# Altium schematic sheet ESP32.SchDoc
size A; SheetNumber: 2; SheetTotal: 5
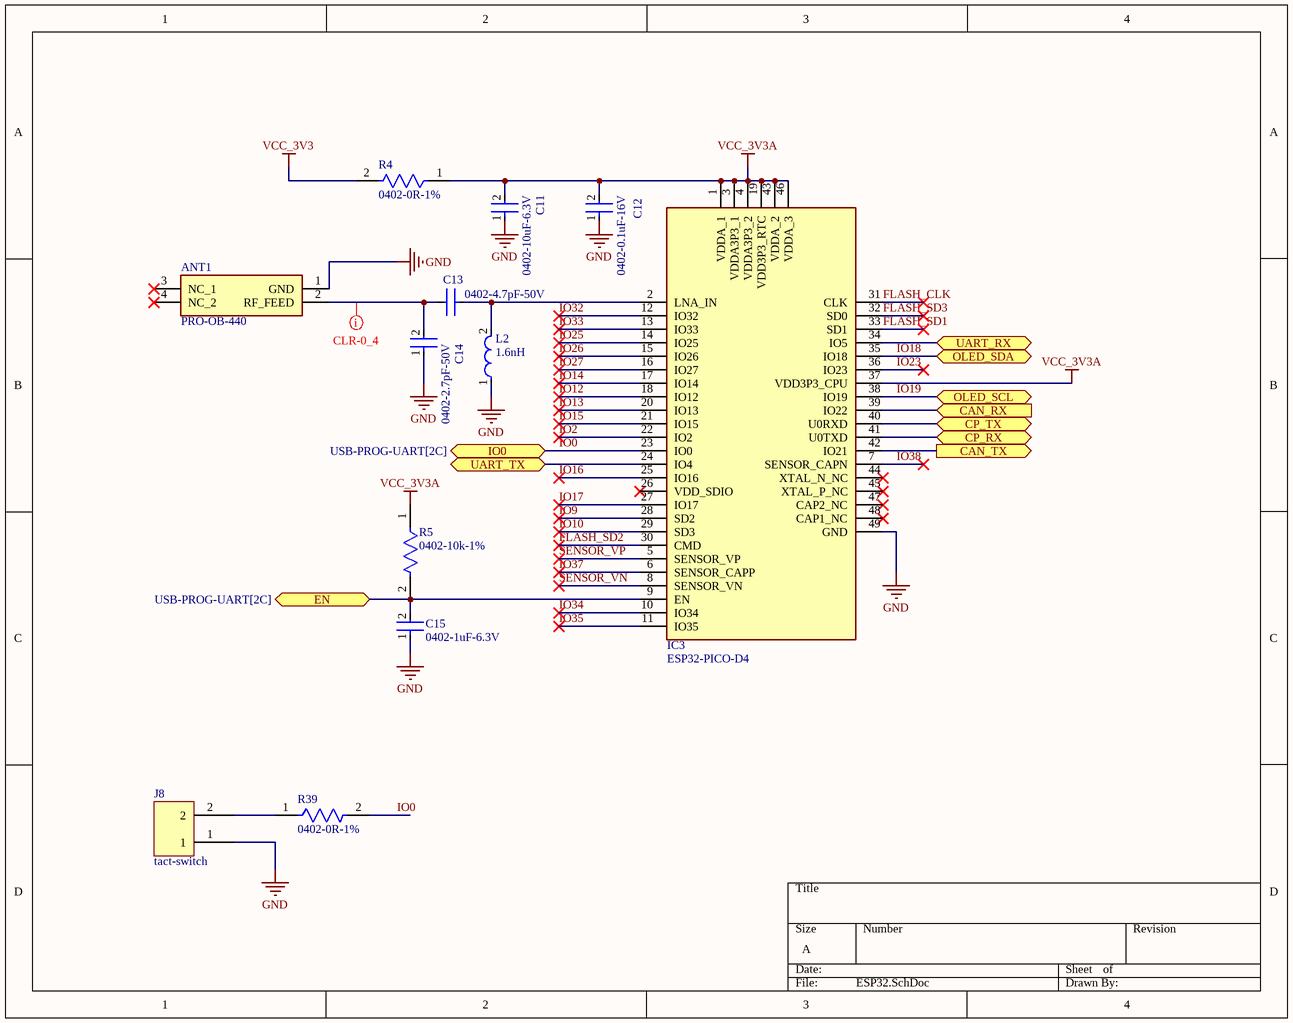
[diagram p0: ESP32.SchDoc]

## Parts
ANT1  PRO-OB-440  [PRO-OB-440_1]
C11  0402-10uF-6.3V  [FP-GRM155-0_05-IPC_A]
C12  0402-0.1uF-16V  [FP-GRM155-0_05-IPC_A]
C13  0402-4.7pF-50V  [FP-GRM155-0_05-IPC_A]
C14  0402-2.7pF-50V  [FP-GRM155-0_05-IPC_A]
C15  0402-1uF-6.3V  [FP-GRM155-0_05-IPC_A]
IC3  ESP32-PICO-D4  [ESP32PICOD4]
J8  tact-switch  [tact-switch]
L2  1.6nH  [FP-LQW15AN_00-W0_6-0_1-MFG]
R4  0402-0R-1%  [FP-CRCW0402-e3-IPC_C]
R5  0402-10k-1%  [FP-CRCW0402-e3-IPC_C]
R39  0402-0R-1%  [FP-CRCW0402-e3-IPC_C]

## Ports
CAN_RX (in, see CAN-POWER-B2B[1C]), CAN_TX (out, see CAN-POWER-B2B[1C]), CP_RX (bidir, see USB-PROG-UART[4A]), CP_TX (bidir, see USB-PROG-UART[4A]), EN (bidir, see USB-PROG-UART[2C]), IO0 (bidir, see USB-PROG-UART[2C]), OLED_SCL (bidir, see CAN-POWER-B2B[3C]), OLED_SDA (bidir, see CAN-POWER-B2B[3C]), UART_RX (bidir, see CAN-POWER-B2B[4B]), UART_TX (bidir, see CAN-POWER-B2B[4B])

## Nets
GND: ANT1.1(GND) C11.1 C12.1 C14.1 C15.1 IC3.49(GND) J8.1 L2.1
VCC_3V3: R4.2
VCC_3V3A: C11.2 C12.2 IC3.1(VDDA_1) IC3.3(VDDA3P3_1) IC3.4(VDDA3P3_2) IC3.19(VDD3P3_RTC) IC3.37(VDD3P3_CPU) IC3.43(VDDA_2) IC3.46(VDDA_3) R4.1 R5.1
CAN_RX: IC3.39(IO22) ; port CAN_RX
CAN_TX: IC3.42(IO21) ; port CAN_TX
CP_RX: IC3.41(U0TXD) ; port CP_RX
CP_TX: IC3.40(U0RXD) ; port CP_TX
EN: C15.2 IC3.9(EN) R5.2 ; port EN
FLASH_CLK: IC3.31(CLK)
FLASH_SD1: IC3.33(SD1)
FLASH_SD2: IC3.30(CMD)
FLASH_SD3: IC3.32(SD0)
IO0: IC3.23(IO0) R39.2 ; port IO0
IO2: IC3.22(IO2)
IO9: IC3.28(SD2)
IO10: IC3.29(SD3)
IO12: IC3.18(IO12)
IO13: IC3.20(IO13)
IO14: IC3.17(IO14)
IO15: IC3.21(IO15)
IO16: IC3.25(IO16)
IO17: IC3.27(IO17)
IO18: IC3.35(IO18) ; port OLED_SDA
IO19: IC3.38(IO19) ; port OLED_SCL
IO23: IC3.36(IO23)
IO25: IC3.14(IO25)
IO26: IC3.15(IO26)
IO27: IC3.16(IO27)
IO32: IC3.12(IO32)
IO33: IC3.13(IO33)
IO34: IC3.10(IO34)
IO35: IC3.11(IO35)
IO37: IC3.6(SENSOR_CAPP)
IO38: IC3.7(SENSOR_CAPN)
SENSOR_VN: IC3.8(SENSOR_VN)
SENSOR_VP: IC3.5(SENSOR_VP)
UART_RX: IC3.34(IO5) ; port UART_RX
UART_TX: IC3.24(IO4) ; port UART_TX
NetANT1_2: ANT1.2(RF_FEED) C13.2 C14.2
NetC13_1: C13.1 IC3.2(LNA_IN) L2.2
NetJ8_2: J8.2 R39.1

Not connected (* = marked no-connect by the designer): ANT1 3(NC_1)* 4(NC_2)*; IC3 26(VDD_SDIO)* 44(XTAL_N_NC)* 45(XTAL_P_NC)* 47(CAP2_NC)* 48(CAP1_NC)*

## Layout directives
net class CLR-0_4: NetANT1_2

## Library data of the parts
ANT1 = PRO-OB-440: Antenna; Manufacturer_Name: Proant AB; Datasheet Link: https://datasheet.datasheetarchive.com/originals/distributors/Datasheets_SAMA/948dc430b75246ce8cd38483dfecf2eb.pdf; Manufacturer_Part_Number: PRO-OB-440
C11-C15 = CMP-2008-04561-5: CAP CER 0.22UF 10V X5R 0402; Tolerance: 10%; Capacitance: 220nF; Material: Ceramic; Insulation Resistance: 10GR; Package Quantity: 1; Termination: SMD/SMT; Max Operating Temperature: 85°C; Voltage: 10V; REACH SVHC: No SVHC; Thickness: 0.022inch; Mount: Surface Mount; Height: 0.5mm; Length: 1mm; Lead Free: Lead Free; Number of Pins: 2; Case Code (Imperial): 0402; Case/Package: 0402; Min Operating Temperature: -55°C; Packaging: Tape and Reel; Dielectric: X5R; Depth: 0.5mm; Series: GRM; Case Code (Metric): 1005; Radiation Hardening: No; RoHS Compliant: Yes; Voltage Rating (DC): 10V; Voltage Rating: 10V; Dielectric Material: Ceramic; Width: 0.5mm
IC3 = ESP32-PICO-D4: Integrated Circuit; Manufacturer_Name: Espressif Systems; Datasheet Link: https://www.espressif.com/sites/default/files/documentation/esp32-pico-d4_datasheet_en.pdf; Height: 1.04mm; Manufacturer_Part_Number: ESP32-PICO-D4; Mouser Part Number: 356-ESP32-PICO-D4; Mouser Price/Stock: https://www.mouser.co.uk/ProductDetail/Espressif-Systems/ESP32-PICO-D4?qs=MLItCLRbWsw7MJlbN3HfdA%3D%3D
L2 = CMP-06042-000827-1: Wire Wound RF Inductor 3.9nH ±0.1nH 750mA 0.07Ω 0402 (1005); Shielding: Unshielded; Self Resonant Frequency: 10GHz; Core Material: Air; Test Frequency: 100MHz; DC Resistance (DCR): 70mR; Length: 1mm; Inductance: 3.9nH; Height: 0.5mm; Case Code (Metric): 1005; Lead Free: Lead Free; Military Standard: Not; Mount: Surface Mount; Current: 750mA; REACH SVHC: No SVHC; Current Rating: 750mA; DC Current: 750mA; Max Operating Temperature: 125°C; Package Quantity: 10000; Packaging: Tape and Reel; Case/Package: 0402; Min Operating Temperature: -55°C; Width: 0.02inch; Depth: 0.7mm; Termination: SMD/SMT; Weight: 2.8E-05oz; Number of Pins: 2; Radiation Hardening: No; Max DC Current: 750mA; Case Code (Imperial): 0402
R4 R5 R39 = CMP-2002-08122-2: RES Thick Film, 0Ω, 0.063W, 0402; Tolerance: 5%; Max Power Dissipation: 63mW; Voltage Rating: 50V; Temperature Coefficient: 100ppm/°C; Resistance: 0mR; Contact Plating: Tin; Height: 0.35mm; Radiation Hardening: No; Features: Automotive AEC-Q200; Composition: Thick Film; Width: 0.5mm; Weight: 2.3E-05oz; Termination: SMD/SMT; Packaging: Tape and Reel; Mount: Surface Mount; Case Code (Metric): 1005; Military Standard: Not; Min Operating Temperature: -55°C; Number of Terminations: 2; Package Quantity: 1; Case Code (Imperial): 0402; Depth: 0.5mm; Max Operating Temperature: 155°C; Case/Package: 0402; Power Rating: 63mW; Lead Free: Lead Free; Voltage Rating (DC): 50V; Length: 1mm